# EAGLE design TempControl  (EAGLE 8.2.2)
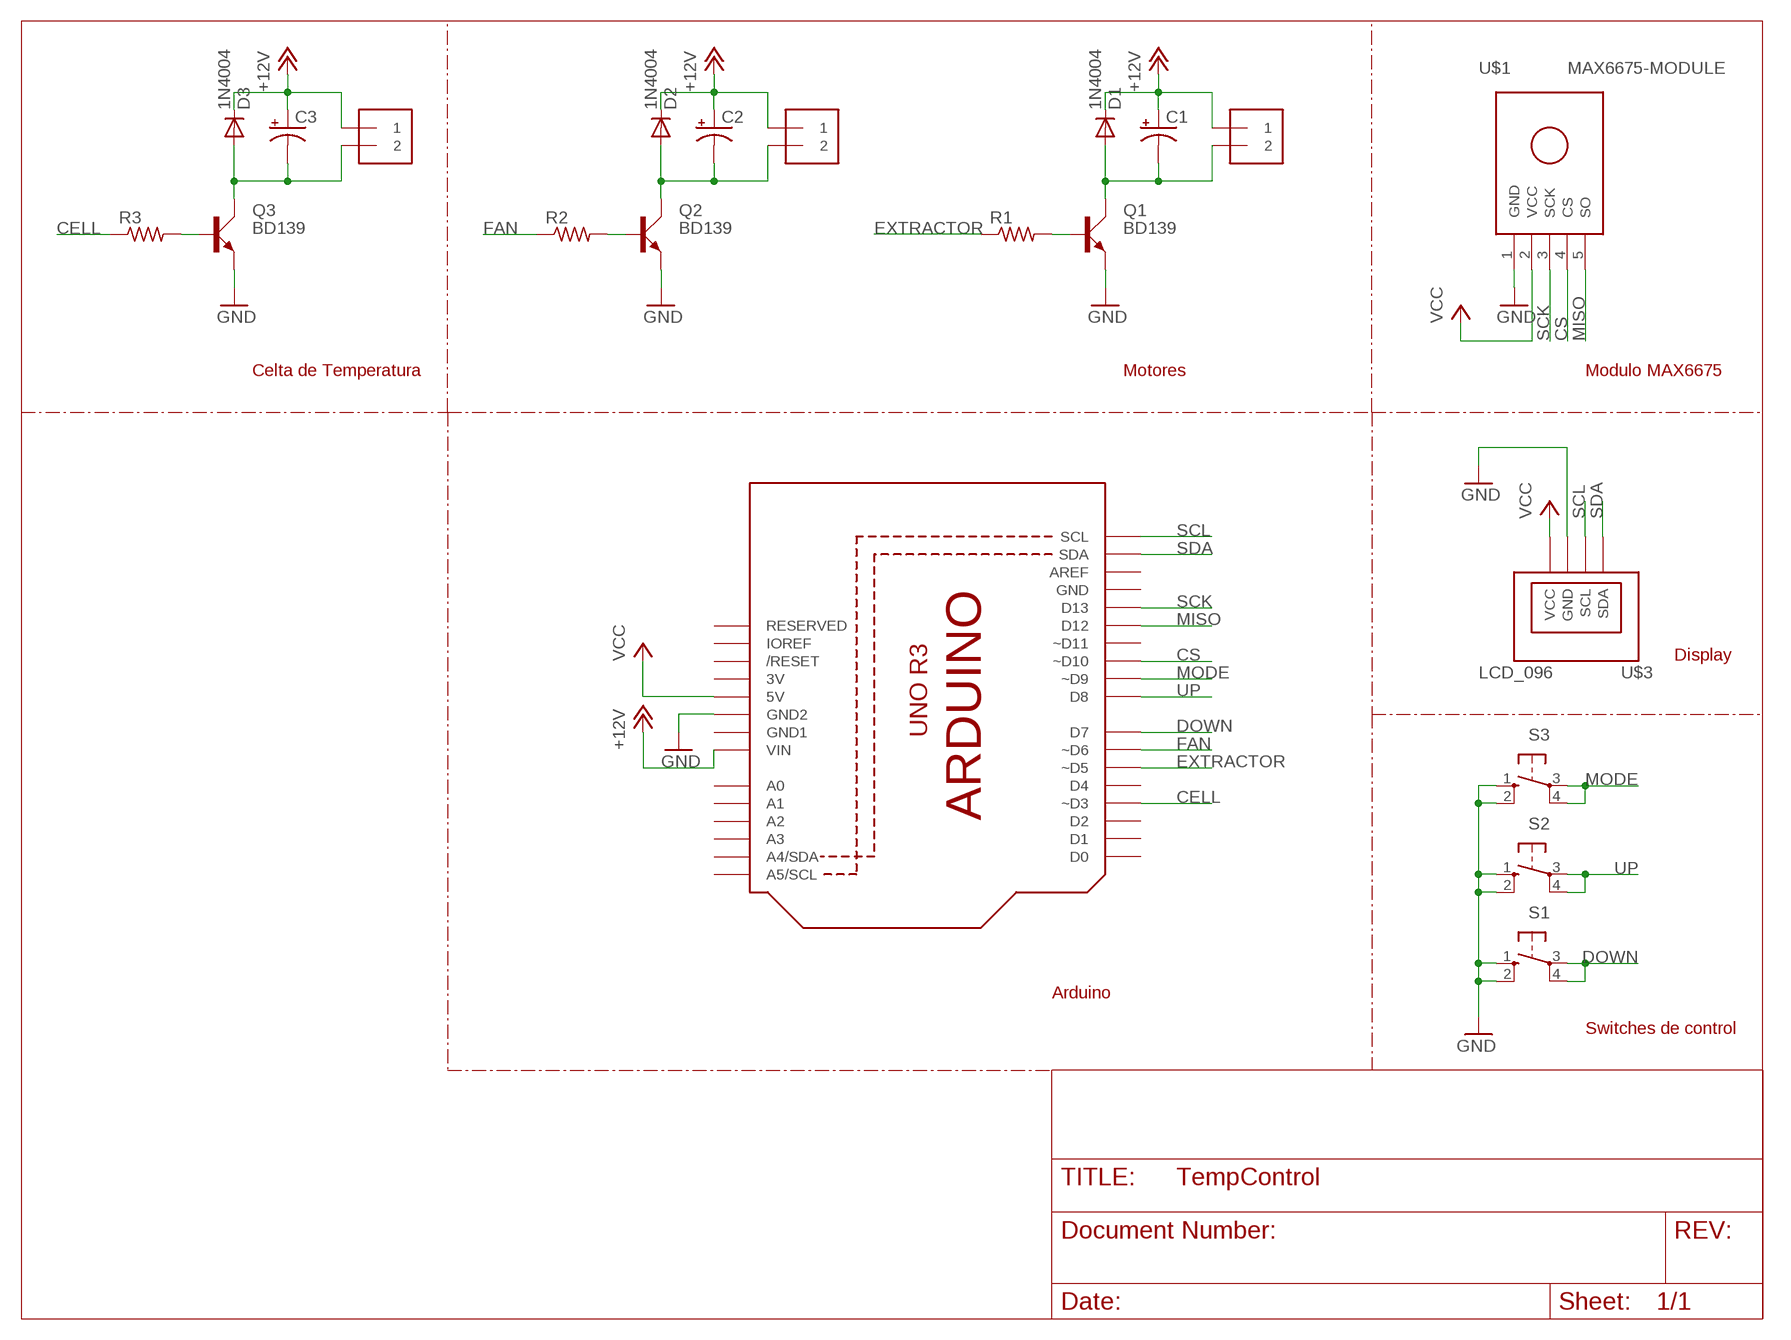
[diagram p0: schematic, sheet 1]

## Parts
C1  CPOL-USTT2D5  [TT2D5]
C2  CPOL-USTT2D5  [TT2D5]
C3  CPOL-USTT2D5  [TT2D5]
CELL  1X2-3.5MM  [1X2-3.5MM]
D1  1N4004  [DO41-10]
D2  1N4004  [DO41-10]
D3  1N4004  [DO41-10]
EXTRACTOR  1X2-3.5MM  [1X2-3.5MM]
FAN  1X2-3.5MM  [1X2-3.5MM]
Q1  BD139  [TO126AV]
Q2  BD139  [TO126AV]
Q3  BD139  [TO126AV]
R1  R-US_0207/10  [0207/10]
R2  R-US_0207/10  [0207/10]
R3  R-US_0207/10  [0207/10]
S1  40-XX-ROUND  [B3F-40XX-ROUND]
S2  40-XX-ROUND  [B3F-40XX-ROUND]
S3  40-XX-ROUND  [B3F-40XX-ROUND]
U1  ARDUINOR3-BPLACE  [ARDUINOR3-BPLACE]
U$1  MAX6675-MODULE  [FE05-1]
U$3  LCD_096  [LCD_096"]

## Nets
+12V: C1.+ C2.+ C3.+ CELL.1 D1.C D2.C D3.C EXTRACTOR.1 FAN.1 U1.VIN
CELL: R3.1 U1.D3(~D3)
CS: U1.D10(~D10) U$1.4(CS)
DOWN: S1.3(P) S1.4(P1) U1.D7
EXTRACTOR: R1.1 U1.D5(~D5)
FAN: R2.1 U1.D6(~D6)
GND: Q1.E Q2.E Q3.E S1.1(S) S1.2(S1) S2.1(S) S2.2(S1) S3.1(S) S3.2(S1) U1.GND2 U$1.1(GND) U$3.P$2(GND)
MISO: U1.D12 U$1.5(SO)
MODE: S3.3(P) S3.4(P1) U1.D9(~D9)
N$1: C2.- D2.A FAN.2 Q2.C
N$2: C1.- D1.A EXTRACTOR.2 Q1.C
N$4: Q1.B R1.2
N$6: Q2.B R2.2
N$8: C3.- CELL.2 D3.A Q3.C
N$9: Q3.B R3.2
SCK: U1.D13 U$1.3(SCK)
SCL: U1.SCL U$3.P$3(SCL)
SDA: U1.SDA U$3.P$4(SDA)
UP: S2.3(P) S2.4(P1) U1.D8
VCC: U1.5V U$1.2(VCC) U$3.P$1(VCC)
Unconnected: U1.A0 U1.A1 U1.A2 U1.A3 U1.A4(A4/SDA) U1.A5(A5/SCL) U1.AREF U1.D0 U1.D1 U1.D2 U1.D4 U1.D11(~D11) U1.IOREF U1.RESERVED U1.RESET(/RESET)

## Notes on the sheet
- Celta de Temperatura | Motores | Modulo MAX6675
- Display
- Arduino
- Switches de control

## Power pins joined to a net without a drawn wire
3V: U1.3V
GND: U1.GND
GND1: U1.GND1

## Library data of the parts
C1-C3 = rcl:CPOL-US: POLARIZED CAPACITOR, American symbol
CELL EXTRACTOR FAN = adafruit:1X2: 3.5mm Terminal block http://www.ladyada.net/library/pcb/eaglelibrary.html
D1-D3 = adafruit:1N4004: DIODE General purpose 1N400x type rectifier (With bigger pads) http://www.ladyada.net/library/pcb/eaglelibrary.html
Q1-Q3 = transistor-power:BD139: NPN TRANSISTOR
R1-R3 = rcl:R-US_: RESISTOR, American symbol
S1-S3 = adafruit:40-XX: OMRON SWITCH
U1 = adafruit:ARDUINOR3: This is a new object for the new Arduino R3 - with extra pins that you may want to use (such as IOref, and duplicated A4/A5
U$1 = MAX6675-MODULE:MAX6675-MODULE
U$3 = lcd OLED:LCD_096

## Board
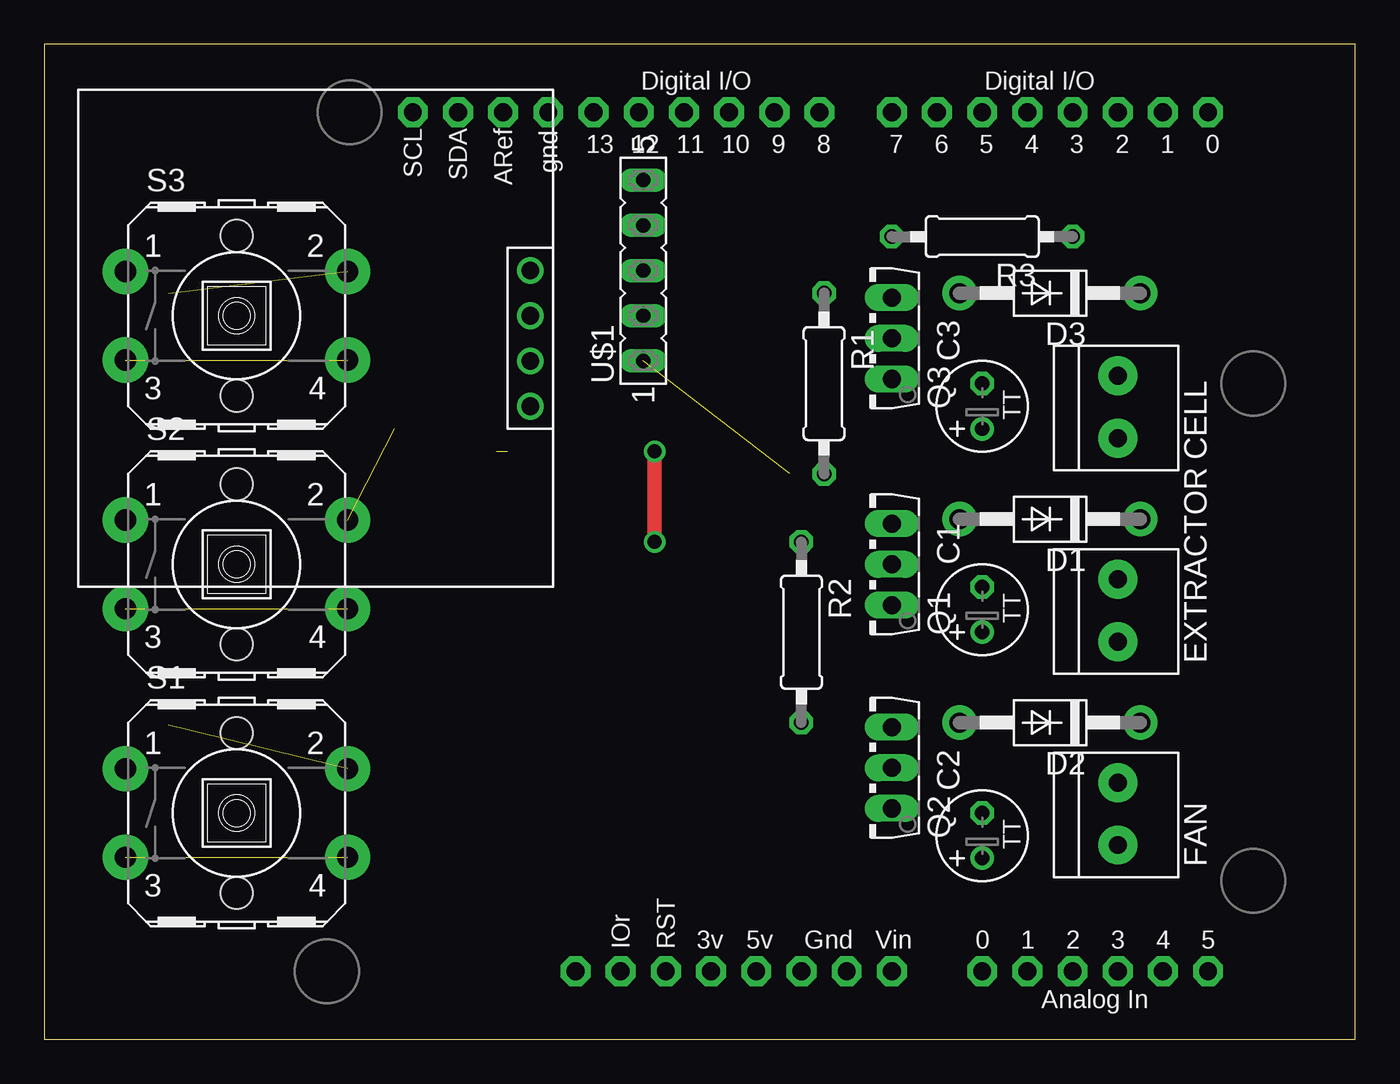
[diagram p1: board, top side]
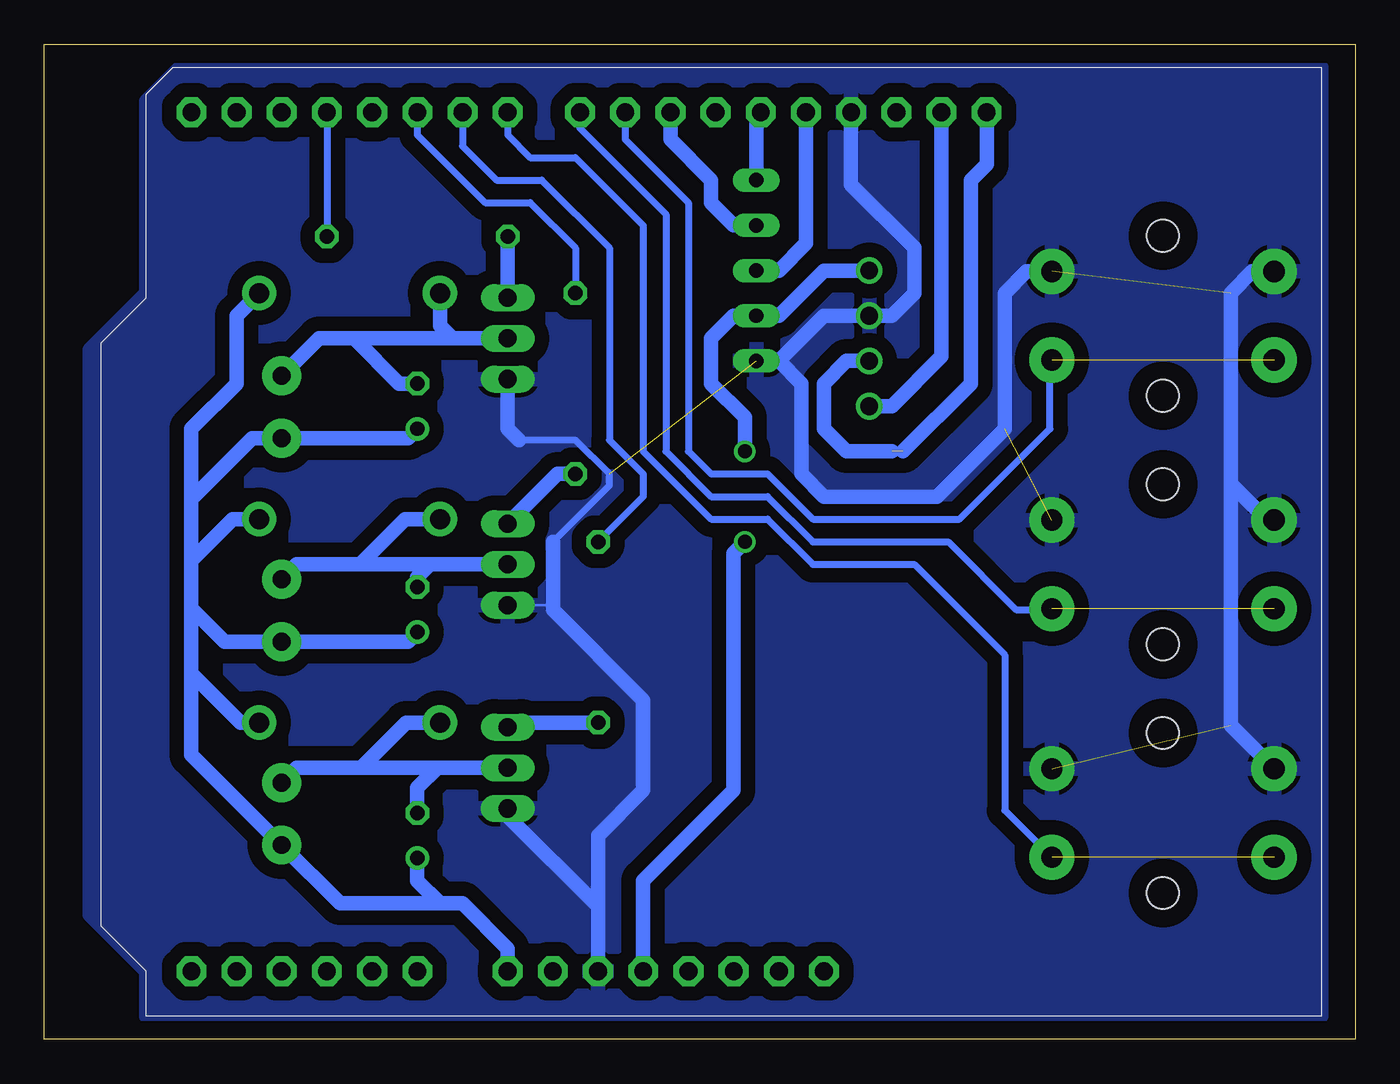
[diagram p2: board, bottom side, seen from below]

Size 73.66 x 55.88 mm. Coordinates in mm from the lower left corner, seen from the top.
Outline: 0,0 73.66,0 73.66,55.88 0,55.88 0,0
Copper layers (1*16): Top 0.035mm / dielectric 1.5mm / Bottom 0.035mm
Design rules "default": minimum track width 6mil, minimum drill 0.35mm, track to track 6mil, track to pad 6mil, pad to pad 6mil, via to via 6mil, smd to smd 6mil, copper to edge 40mil, drill to drill 6mil, minimum pad ring 10mil, minimum via ring 8mil, stop-mask expansion 4mil, vias tented up to drill 0mil, thermal gap 10mil

### Footprints (pad centres in the part's own frame; a part is rotated, then mirrored left to right if it is on the bottom)
TT2D5 = drill 0.813: + -1.27,0 | drill 0.813 octagon: - 1.27,0
1X2-3.5MM = drill 1 pad 2.184: 1 1.8,0; 2 -1.7,0
DO41-10 = drill 1.118 pad 1.93: A 5.08,0; C -5.08,0
TO126AV = drill 1.016 long: B 2.286,-1.27; C 0,-1.27; E -2.286,-1.27
0207/10 = drill 0.813 octagon: 1 -5.08,0; 2 5.08,0
B3F-40XX-ROUND = drill 1.194 pad 2.54: 1 -6.248,2.489; 2 6.248,2.489; 3 -6.248,-2.489; 4 6.248,-2.489 | hole 1.803: 0,-4.496; 0,4.496
ARDUINOR3-BPLACE = drill 1 pad 1.676 octagon: 3V 35.56,2.54; 5V 38.1,2.54; A0 50.8,2.54; A1 53.34,2.54; A2 55.88,2.54; A3 58.42,2.54; A4 60.96,2.54; A5 63.5,2.54; AREF 23.876,50.8; D0 63.5,50.8; D1 60.96,50.8; D2 58.42,50.8; D3 55.88,50.8; D4 53.34,50.8; D5 50.8,50.8; D6 48.26,50.8; D7 45.72,50.8; D8 41.656,50.8; D9 39.116,50.8; D10 36.576,50.8; D11 34.036,50.8; D12 31.496,50.8; D13 28.956,50.8; GND 26.416,50.8; GND1 43.18,2.54; GND2 40.64,2.54; IOREF 30.48,2.54; RESERVED 27.94,2.54; RESET 33.02,2.54; SCL 18.796,50.8; SDA 21.336,50.8; VIN 45.72,2.54
FE05-1 = drill 0.813 long: 1 -5.08,0; 2 -2.54,0; 3 0,0; 4 2.54,0; 5 5.08,0
LCD_096" = drill 1: P$1 -3.81,10.16; P$2 -1.27,10.16; P$3 1.27,10.16; P$4 3.81,10.16

### Placement (x,y rotation side)
C1  52.7,24.13 90 top
C2  52.7,11.43 90 top
C3  52.7,35.56 90 top
CELL  60.33,35.56 270 top
D1  56.52,29.21 180 top
D2  56.52,17.78 180 top
D3  56.52,41.91 180 top
EXTRACTOR  60.33,24.13 270 top
FAN  60.33,12.7 270 top
Q1  46.35,26.67 90 top
Q2  46.35,15.24 90 top
Q3  46.35,39.37 90 top
R1  43.81,36.83 270 top
R2  42.55,22.86 270 top
R3  52.7,45.09 180 top
S1  10.79,12.7 0 top
S2  10.79,26.67 0 top
S3  10.79,40.64 0 top
U1  1.91,1.27 0 top
U$1  33.66,43.18 90 top
U$3  17.14,39.37 270 top

### Tracks (layer width: path | path; a pad name or v marks a point on that pad's centre or on a via)
+12V
  Bottom 0.813: D3.C 62.87,40.64 62.87,36.83 65.41,34.29 65.41,30.33 | 65.41,26.88 65.41,30.33 | 65.41,24.2 65.41,26.88 | 65.41,24.2 65.41,20.56 | 65.41,20.56 65.41,15.98 FAN.1 57.05,7.62 51.44,7.62 | D2.C 62.62,17.78 65.41,20.56 | 65.41,30.33 61.98,33.76 CELL.1 53.23,33.76 C3.+ | D1.C 63.07,29.21 65.41,26.88 | 65.41,24.2 63.54,22.33 EXTRACTOR.1 53.23,22.33 C1.+ | U1.VIN 47.62,5.08 50.16,7.62 51.44,7.62 | C2.+ 52.7,8.89 51.44,7.62
CELL
  Bottom 0.406: U1.D3 R3.1
CS
  Bottom 0.813: U1.D10 38.48,50.55 36.2,48.26 36.2,46.99 34.92,45.72 U$1.4
DOWN  (1 unrouted)
  Bottom 0.406: U1.D7 47.62,50.8 46.35,49.53 43.81,49.53 40.01,45.72 40.01,33.02 36.2,29.21 33.02,29.21 30.48,26.67 24.77,26.67 19.68,21.59 19.68,12.85 S1.4
EXTRACTOR
  Bottom 0.406: U1.D5 52.7,50.8 48.9,46.99 46.35,46.99 43.81,44.45 R1.1
FAN
  Bottom 0.406: U1.D6 50.16,50.16 48.26,48.26 45.72,48.26 41.91,44.45 41.91,33.66 40.01,31.75 40.01,30.48 R2.1
GND  (4 unrouted)
  Bottom 0.152: 45.09,24.38 Q1.E
  Bottom 0.406: 45.09,27.94 41.91,31.11 41.91,31.75 43.81,33.66 46.99,33.66
  Bottom 0.813: 45.09,27.94 45.09,24.38 45.09,24.13 40.01,19.05 40.01,13.97 42.55,11.43 42.55,7.45 | 42.55,7.45 U1.GND2 | Q2.E 47.62,12.53 42.55,7.45 | 32.38,38.1 U$1.1 | U1.GND 28.32,48.01 24.77,44.45 24.77,41.91 26.04,40.64 U$3.P$2 29.84,40.64 32.38,38.1 | S3.2 18.47,43.13 19.68,41.91 19.68,34.29 23.5,30.48 29.84,30.48 31.11,31.75 31.11,36.83 32.38,38.1 | Q3.E 47.62,34.29 46.99,33.66 | S3.1 5.77,43.13 6.99,41.91 6.99,31.2 | 6.99,31.2 6.99,17.63 S1.1 | S2.1 4.94,29.16 6.99,31.2
  pour Bottom (isolate 0.813): 1.91,54.61 66.04,54.61 67.94,52.7 67.94,41.91 71.12,38.73 71.12,6.99 67.94,3.81 67.94,1.27 1.91,1.27
MISO
  Bottom 0.813: U$1.5 33.66,51.82 U1.D12
MODE  (1 unrouted)
  Bottom 0.406: U1.D9 41.02,50.55 37.47,46.99 37.47,33.02 36.2,31.75 33.02,31.75 30.48,29.21 22.23,29.21 17.14,34.29 17.14,38.05 S3.4
N$1
  Bottom 0.813: 51.58,15.24 Q2.C | 55.87,15.24 51.58,15.24 | 55.87,15.24 59.48,15.24 FAN.2 | C2.- 52.7,14.11 51.58,15.24 | D2.A 53.33,17.78 55.87,15.24
N$2
  Bottom 0.813: 51.99,26.67 Q1.C | 55.93,26.67 51.99,26.67 | 55.93,26.67 59.48,26.67 EXTRACTOR.2 | C1.- 52.7,25.96 51.99,26.67 | D1.A 53.39,29.21 55.93,26.67
N$4
  Bottom 0.813: R1.2 44.83,31.75 Q1.B
N$6
  Bottom 0.813: R2.2 47.37,17.78 Q2.B
N$8
  Bottom 0.813: CELL.2 58.22,39.37 56.26,39.37 | 50.72,39.37 56.26,39.37 | C3.- 53.72,36.83 56.26,39.37 | D3.A 51.44,40.09 50.72,39.37 | 50.72,39.37 Q3.C
N$9
  Bottom 0.813: R3.2 Q3.B
SCK
  Bottom 0.813: U1.D13 30.86,44.7 32.38,43.18 U$1.3
SCL  (1 unrouted)
  Bottom 0.813: U$3.P$3 28.57,38.1 29.84,36.83 29.84,34.29 28.57,33.02 26.04,33.02 | U1.SCL 20.7,49.15 21.59,48.26 21.59,36.83 25.4,33.02
SDA
  Bottom 0.813: U1.SDA 23.24,38.35 26.04,35.56 U$3.P$4
UP  (1 unrouted)
  Bottom 0.406: U1.D8 43.56,51.18 38.73,46.35 38.73,33.02 36.2,30.48 33.02,30.48 30.48,27.94 22.86,27.94 19.05,24.13 17.09,24.13 S2.4
VCC  (via drill 0.8)
  Top 0.813: v34.29,27.94 v34.29,33.02
  Bottom 0.813: U$3.P$1 29.84,43.18 32.38,40.64 U$1.2 34.92,40.64 36.2,39.37 36.2,36.83 34.29,34.92 v34.29,33.02 | U1.5V 40.01,8.89 34.92,13.97 34.92,27.3 v34.29,27.94